# Altium project computadordebordo.PrjPcb
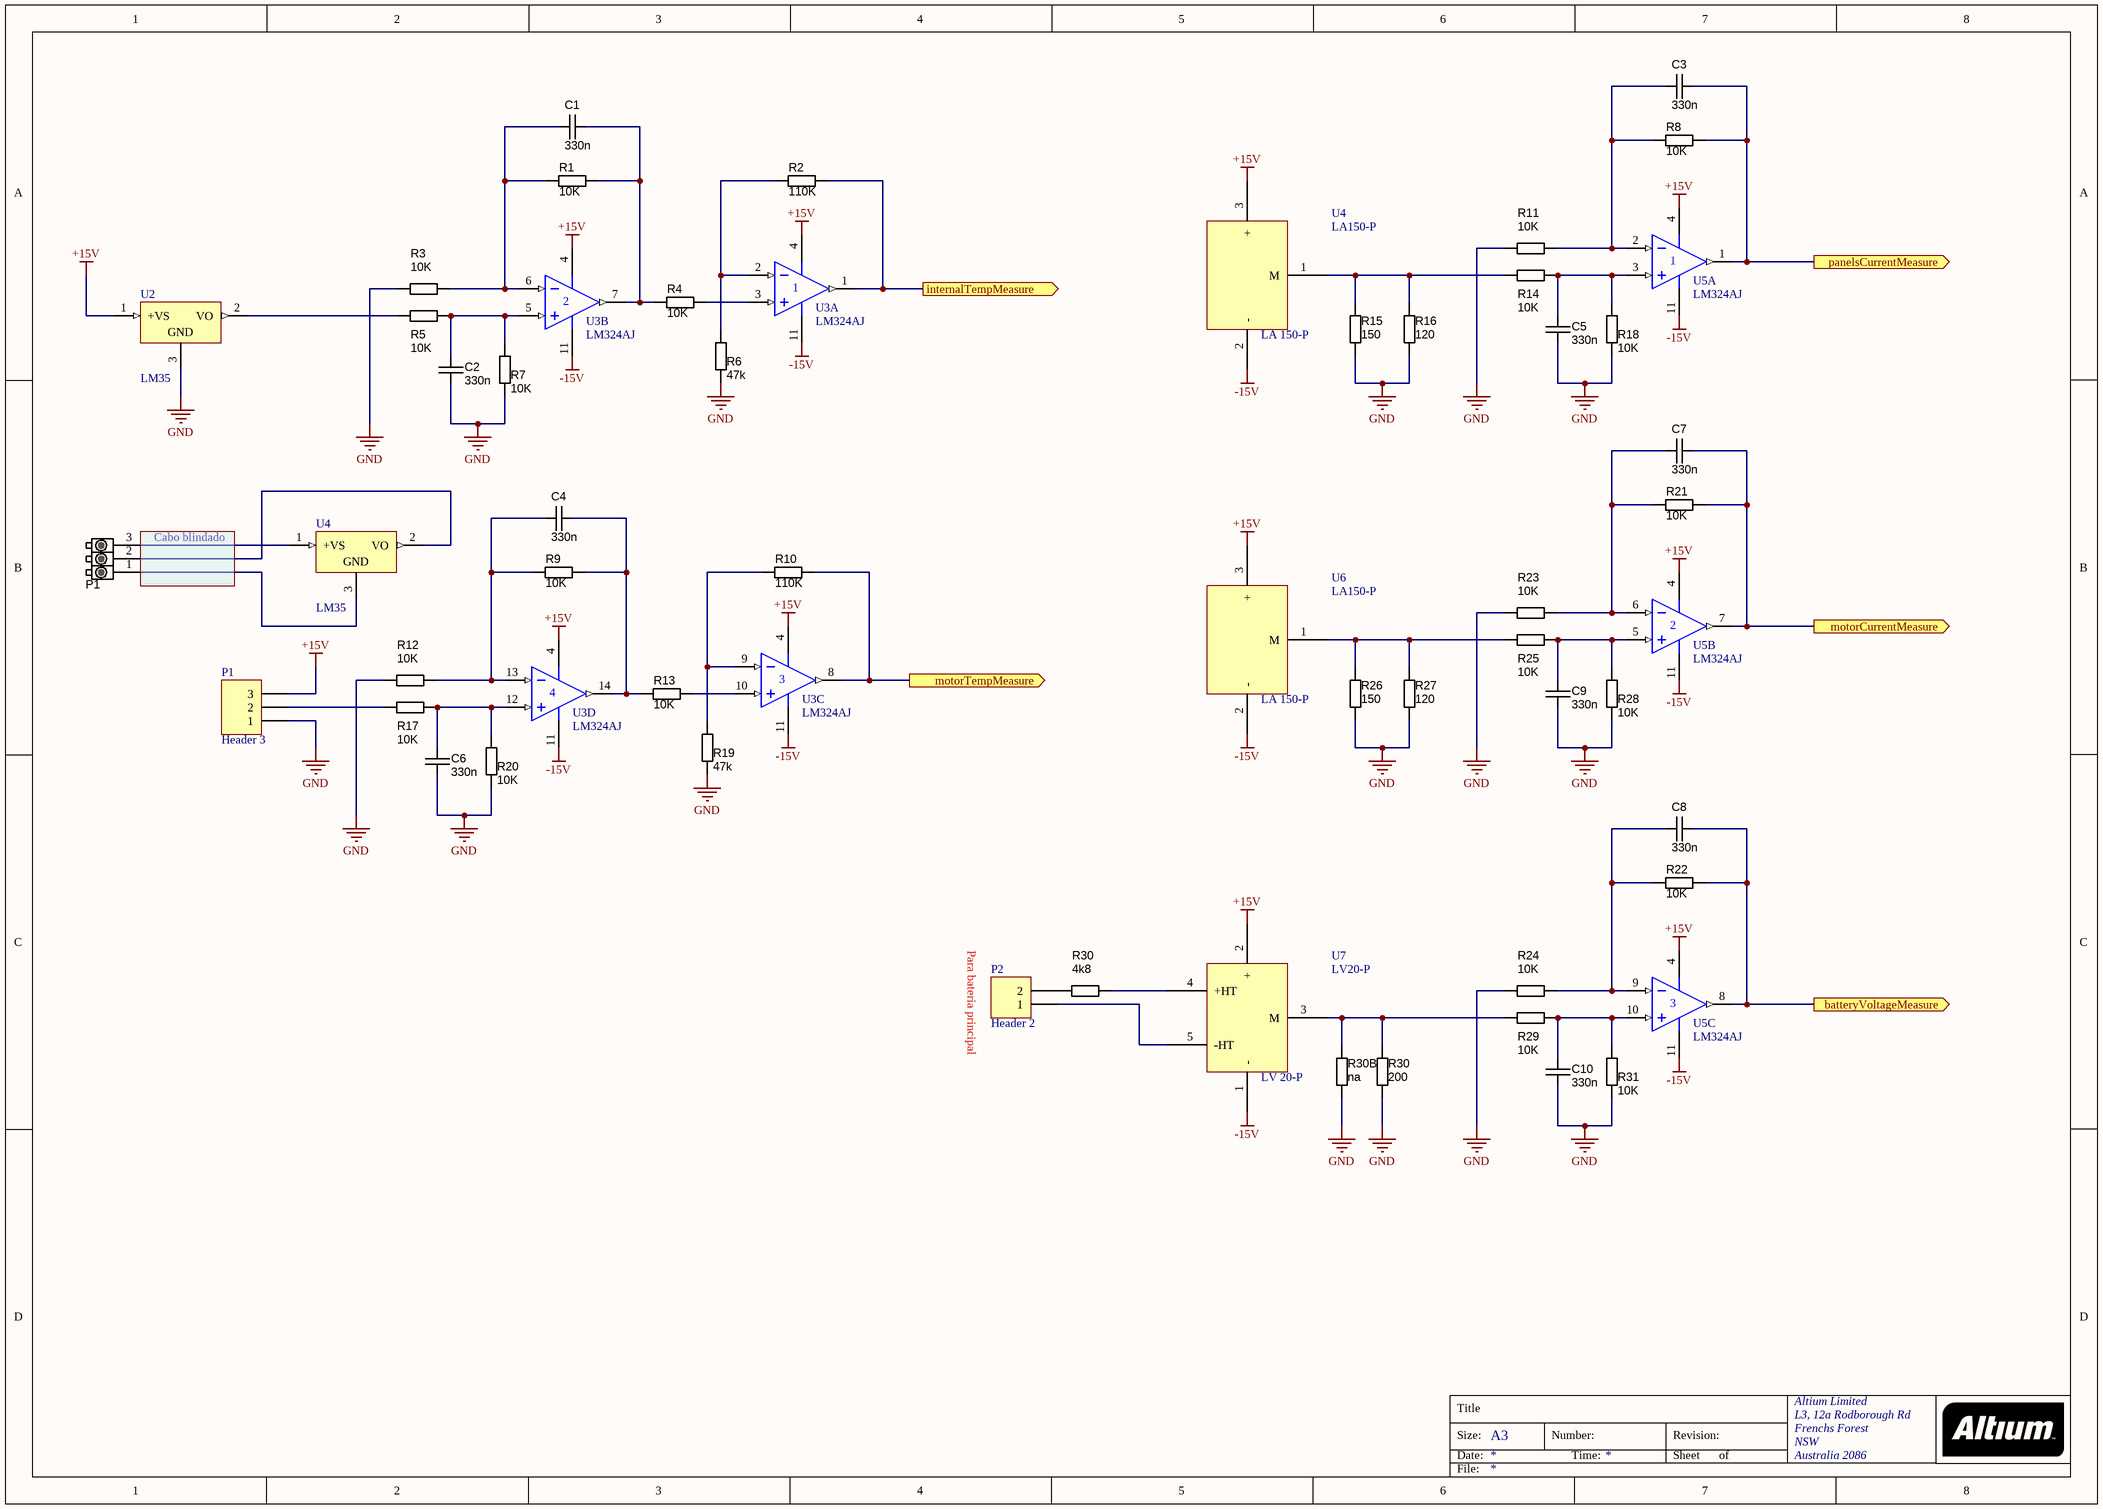
[diagram p0: sensor.SchDoc]
3 sheets, 93 parts. Net scope: flat (ports and power ports of the same name join across sheets).
Board files: PCB3_fresa_v1.1A.PcbDoc, PCB3_fresa_v1.1B.pcbdoc, PCB1.PcbDoc
Sheets:
  sensor.SchDoc
  supplies.SchDoc
  arduinoshield.SchDoc

## Sheet sensor.SchDoc
size A3; Organization: Altium Limited; Address1: L3, 12a Rodborough Rd; Address2: Frenchs Forest; Address3: NSW; Address4: Australia 2086

### Parts
(Parts that share a designator on the sheet are numbered #1, #2 ... from top to bottom, then left to right.)
C1  value 330n  [cap33n63v]  (hidden comment: approved sub OK)
C2  value 330n  [cap33n63v]  (hidden comment: approved sub OK)
C3  value 330n  [cap33n63v]  (hidden comment: approved sub OK)
C4  value 330n  [cap33n63v]  (hidden comment: approved sub OK)
C5  value 330n  [cap33n63v]  (hidden comment: approved sub OK)
C6  value 330n  [cap33n63v]  (hidden comment: approved sub OK)
C7  value 330n  [cap33n63v]  (hidden comment: approved sub OK)
C8  value 330n  [cap33n63v]  (hidden comment: approved sub OK)
C9  value 330n  [cap33n63v]  (hidden comment: approved sub OK)
C10  value 330n  [cap33n63v]  (hidden comment: approved sub OK)
P1#1  3P_TERM BLOCK PLUG  (value not drawn)  (graphical)
P1#2  Header 3  [HDR1X3]
P2  Header 2  [HDR1X2]
R1  value 10K  [RESTH_AXIAL-0.4]  (hidden comment: Carbon Film)
R2  value 110K  [RESTH_AXIAL-0.4]  (hidden comment: Carbon Film)
R3  value 10K  [RESTH_AXIAL-0.4]  (hidden comment: Carbon Film)
R4  value 10K  [RESTH_AXIAL-0.4]  (hidden comment: Carbon Film)
R5  value 10K  [RESTH_AXIAL-0.4]  (hidden comment: Carbon Film)
R6  value 47k  [RESTH_AXIAL-0.4]  (hidden comment: Carbon Film)
R7  value 10K  [RESTH_AXIAL-0.4]  (hidden comment: Carbon Film)
R8  value 10K  [RESTH_AXIAL-0.4]  (hidden comment: Carbon Film)
R9  value 10K  [RESTH_AXIAL-0.4]  (hidden comment: Carbon Film)
R10  value 110K  [RESTH_AXIAL-0.4]  (hidden comment: Carbon Film)
R11  value 10K  [RESTH_AXIAL-0.4]  (hidden comment: Carbon Film)
R12  value 10K  [RESTH_AXIAL-0.4]  (hidden comment: Carbon Film)
R13  value 10K  [RESTH_AXIAL-0.4]  (hidden comment: Carbon Film)
R14  value 10K  [RESTH_AXIAL-0.4]  (hidden comment: Carbon Film)
R15  value 150  [RESTH_AXIAL-0.4]  (hidden comment: Carbon Film)
R16  value 120  [RESTH_AXIAL-0.4]  (hidden comment: Carbon Film)
R17  value 10K  [RESTH_AXIAL-0.4]  (hidden comment: Carbon Film)
R18  value 10K  [RESTH_AXIAL-0.4]  (hidden comment: Carbon Film)
R19  value 47k  [RESTH_AXIAL-0.4]  (hidden comment: Carbon Film)
R20  value 10K  [RESTH_AXIAL-0.4]  (hidden comment: Carbon Film)
R21  value 10K  [RESTH_AXIAL-0.4]  (hidden comment: Carbon Film)
R22  value 10K  [RESTH_AXIAL-0.4]  (hidden comment: Carbon Film)
R23  value 10K  [RESTH_AXIAL-0.4]  (hidden comment: Carbon Film)
R24  value 10K  [RESTH_AXIAL-0.4]  (hidden comment: Carbon Film)
R25  value 10K  [RESTH_AXIAL-0.4]  (hidden comment: Carbon Film)
R26  value 150  [RESTH_AXIAL-0.4]  (hidden comment: Carbon Film)
R27  value 120  [RESTH_AXIAL-0.4]  (hidden comment: Carbon Film)
R28  value 10K  [RESTH_AXIAL-0.4]  (hidden comment: Carbon Film)
R29  value 10K  [RESTH_AXIAL-0.4]  (hidden comment: Carbon Film)
R30#1  value 4k8  [RESTH_AXIAL-0.4]  (hidden comment: Carbon Film)
R30#2  value 200  [RESTH_AXIAL-0.4]  (hidden comment: Carbon Film)
R30B  value na  [RESTH_AXIAL-0.4]  (hidden comment: Carbon Film)
R31  value 10K  [RESTH_AXIAL-0.4]  (hidden comment: Carbon Film)
U2  LM35  [Z03A]
U3  LM324AJ  [J014]  (parts A,B,C,D of 4)
U4#1  LA150-P  [LA150-P]
U4#2  LM35  [Z03A]  (graphical)
U5  LM324AJ  [J014]  (parts A,B,C of 4)
U6  LA150-P  [LA150-P]
U7  LV20-P  [LV20-P]

### Ports
batteryVoltageMeasure (out), internalTempMeasure (out), motorCurrentMeasure (out), motorTempMeasure (out), panelsCurrentMeasure (out)

### Nets
+15V: P1#2.3 U2.1(+VS) U3.4(V+) U4#1.3(+) U5.4(V+) U6.3(+) U7.2(+)
-15V: U3.11(V-) U4#1.2(-) U5.11(V-) U6.2(-) U7.1(-)
GND: C2.2 C5.2 C6.2 C9.2 C10.2 P1#2.1 R3.1 R6.2 R7.2 R11.1 R12.1 R15.2 R16.2 R18.2 R19.2 R20.2 R23.1 R24.1 R26.2 R27.2 R28.2 R30#2.2 R30B.2 R31.2 U2.3(GND)
AD0: R2.1 U3.1(OUT) ; port internalTempMeasure
AD1: R10.1 U3.8(OUT) ; port motorTempMeasure
AD2: C8.2 R22.2 U5.8(OUT) ; port batteryVoltageMeasure
AD3: C3.2 R8.2 U5.1(OUT) ; port panelsCurrentMeasure
AD4: C7.2 R21.2 U5.7(OUT) ; port motorCurrentMeasure
NetC1_1: C1.1 R1.1 R3.2 U3.6(IN-)
NetC1_2: C1.2 R1.2 R4.2 U3.7(OUT)
NetC2_1: C2.1 R5.2 R7.1 U3.5(IN+)
NetC3_1: C3.1 R8.1 R11.2 U5.2(IN-)
NetC4_1: C4.1 R9.1 R12.2 U3.13(IN-)
NetC4_2: C4.2 R9.2 R13.2 U3.14(OUT)
NetC5_1: C5.1 R14.2 R18.1 U5.3(IN+)
NetC6_1: C6.1 R17.2 R20.1 U3.12(IN+)
NetC7_1: C7.1 R21.1 R23.2 U5.6(IN-)
NetC8_1: C8.1 R22.1 R24.2 U5.9(IN-)
NetC9_1: C9.1 R25.2 R28.1 U5.5(IN+)
NetC10_1: C10.1 R29.2 R31.1 U5.10(IN+)
NetP1#1_1: P1#1.1 U4#2.3(GND)
NetP1#1_2: P1#1.2 U4#2.2(VO)
NetP1#1_3: P1#1.3 U4#2.1(+VS)
NetP1#2_2: P1#2.2 R17.1
NetP2_1: P2.1 U7.5(-HT)
NetP2_2: P2.2 R30#1.1
NetR2_2: R2.2 R6.1 U3.2(IN-)
NetR4_1: R4.1 U3.3(IN+)
NetR5_1: R5.1 U2.2(VO)
NetR10_2: R10.2 R19.1 U3.9(IN-)
NetR13_1: R13.1 U3.10(IN+)
NetR14_1: R14.1 R15.1 R16.1 U4#1.1(M)
NetR25_1: R25.1 R26.1 R27.1 U6.1(M)
NetR29_1: R29.1 R30#2.1 R30B.1 U7.3(M)
NetR30#1_2: R30#1.2 U7.4(+HT)

### Notes on the sheet
- (near P1#1) Cabo blindado
- Para bateria principal
- Title
- Size:
- Date:
- A3
- Number:
- Time:
- Revision:
- Sheet
- of
- File:
- (in symbol LA150-P) LA 150-P
- (in symbol LV20-P) LV 20-P

### Library data of the parts
C1-C10 = CAPC_330n_0805: Capacitor SMD Cer 330nF 10% 25V X7R 0805; Manufacturer: Kemet; Manufacturer Part Number: C0805C334K3RACTU; Ratings: 25V; X7R; Material: ceramic; Package / Case: 0805 (2012 metric); Tolerance: ±10%; Supplier 1: Mouser; Supplier Part Number 1: 80-C0805C334K3R
P1#1 = 3P_TERM BLOCK PLUG: Terminal block plug 3-position 3.81mm pitch; Manufacturer 1: TE Connectivity; Manufacturer Part Number 1: 284507-3; Pitch: 0.150" (3.81mm); Voltage: 300V; Mating Connector: 284517-3; Value: 3 position; Positions Per Level: 3; Plug Wire Entry: 180°; Wire Gauge: 14-30 AWG; Category: Connectors; Mounting Type: Free Hanging (In-Line); Terminal Block Type: Plug, Female Sockets; Supplier 1: Digi-Key; Supplier Part Number 1: A98380-ND; ComponentLink2URL: http://www.te.com/commerce/DocumentDelivery/DDEController?Action=srchrtrv&DocNm=284507&DocType=Customer+Drawing&DocLang=English; ComponentLink2Description: http://www.te.com/commerce/DocumentDelivery/DDEController?Action=srchrtrv&DocNm=284507&DocType=Customer+Drawing&DocLang=English
P1#2 = Header 3: Header, 3-Pin; LatestRevisionDate: 17-Jul-2002; LatestRevisionNote: Re-released for DXP Platform.; Publisher: Altium Limited
P2 = Header 2: Header, 2-Pin; LatestRevisionDate: 17-Jul-2002; LatestRevisionNote: Re-released for DXP Platform.; Publisher: Altium Limited
R1-R29 R30#1 R30#2 R30B R31 = RES_1K_Axial_0.25W_5%: Resistor THD Axial 1k Ohm 0.25W 5% Carbon Film; Manufacturer 1: Yageo; Manufacturer Part Number 1: CFR-25JB-1K0; Ratings: 1/4W; Tolerance: ±5%; Package / Case: Axial; Supplier 1: Digi-Key; Supplier Part Number 1: 1.0KQBK-ND
U2 U4#2 = LM35CAZ: Precision Centigrade Temperature Sensor, 3-pin TO-92; Manufacturer: National Semiconductor; PackageTopMarking: NSXYTT*LM35*CAZ; PowerWise: N; CompType: Temp Sensor IC; Published: 4-Dec-2008; LatestRevisionDate: 15-Jul-2009; LatestRevisionNote: Sch pins 1 & 3 reversed.; DatasheetVersion: Nov-2000; PackageVersion: revG, Sep-2000; PackageReference: Z03A; Publisher: Altium Limited; PackageDescription: TO-92, Molded, 3 Lead; Supplier 1: Farnell; Supplier Part Number 1: 9494529; PartNumber: LM35CAZ; RoHS: N; PinCount: 3; Code_JEDEC: TO-226-AA; ComponentLink1Description: LM35 Datasheet; ComponentLink1URL: http://www.national.com/ds/LM/LM35.pdf; ComponentLink2Description: LM35 Web Page; ComponentLink2URL: http://www.national.com/pf/LM/LM35.html; ComponentLink3Description: Z03A Package Page; ComponentLink3URL: http://www.national.com/packaging/folders/z03a.html
U3 U5 = LM324AJ: Quadruple Operational Amplifier; Published: 15-Apr-2002; LatestRevisionDate: 04-Mar-2005; LatestRevisionNote: Stylized 3D Model Added.; DatasheetVersion: Jan-1989; PackageVersion: Jun-1999; PackageReference: J014; Publisher: Altium Limited; PackageDescription: DIP; 14 Leads; Row Spacing 7.62 mm; Pitch 2.54 mm; ComponentLink1Description: Manufacturer Link; ComponentLink1URL: http://www.ti.com/; ComponentLink2Description: Datasheet; ComponentLink2URL: http://www-s.ti.com/sc/ds/lm324.pdf
U4#1 U6 = LA150-P: Current Transducer
U7 = LV20-P: Voltage Transducer

## Sheet supplies.SchDoc
size A4; Organization: Altium Limited; Address1: L3, 12a Rodborough Rd; Address2: Frenchs Forest; Address3: NSW; Address4: Australia 2086
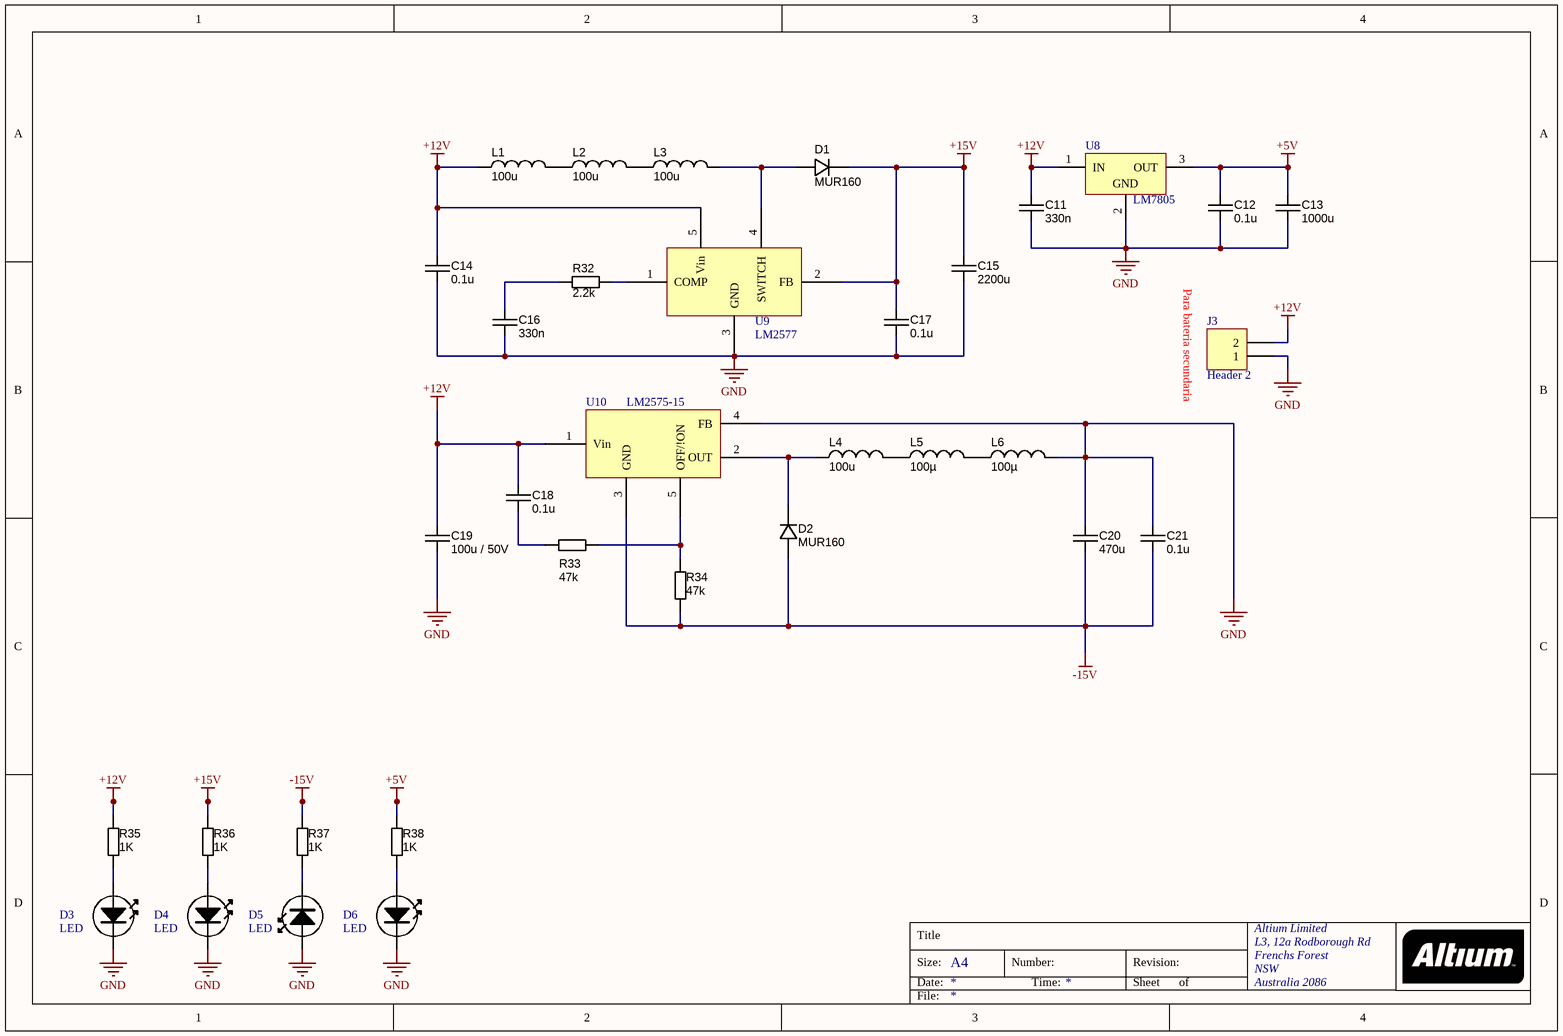
[diagram p1: supplies.SchDoc]

### Parts
C11  value 330n  [cap33n63v]  (hidden comment: approved sub OK)
C12  value 0.1u  [cap100n]  (hidden comment: approved sub OK)
C13  value 1000u  [cap1000u25v]  (hidden comment: approved sub OK)
C14  value 0.1u  [cap100n]  (hidden comment: approved sub OK)
C15  value 2200u  [cap2200u25v]  (hidden comment: approved sub OK)
C16  value 330n  [cap33n63v]  (hidden comment: approved sub OK)
C17  value 0.1u  [cap100n]  (hidden comment: approved sub OK)
C18  value 0.1u  [cap100n]  (hidden comment: approved sub OK)
C19  value 100u / 50V  [cap100u35v]  (hidden comment: approved sub OK)
C20  value 470u  [cap470u50v]  (hidden comment: approved sub OK)
C21  value 0.1u  [cap100n]  (hidden comment: approved sub OK)
D1  MUR160  [DO-41]
D2  MUR160  [DO-41]
D3  LED  [LED-3MM-BLUE]
D4  LED  [LED-3MM-BLUE]
D5  LED  [LED-3MM-BLUE]
D6  LED  [LED-3MM-BLUE]
J3  Header 2  [HDR1X2]
L1  value 100u  [Inductor]  (hidden comment: INDC_180u_Toroid)
L2  value 100u  [Inductor]  (hidden comment: INDC_180u_Toroid)
L3  value 100u  [Inductor]  (hidden comment: INDC_180u_Toroid)
L4  value 100u  [Inductor]  (hidden comment: INDC_180u_Toroid)
L5  value 100µ  [Inductor]  (hidden comment: INDC_180u_Toroid)
L6  value 100µ  [Inductor]  (hidden comment: INDC_180u_Toroid)
R32  value 2.2k  [RESTH_AXIAL-0.4]  (hidden comment: Carbon Film)
R33  value 47k  [RESTH_AXIAL-0.4]  (hidden comment: Carbon Film)
R34  value 47k  [RESTH_AXIAL-0.4]  (hidden comment: Carbon Film)
R35  value 1K  [RESTH_AXIAL-0.4]  (hidden comment: Carbon Film)
R36  value 1K  [RESTH_AXIAL-0.4]  (hidden comment: Carbon Film)
R37  value 1K  [RESTH_AXIAL-0.4]  (hidden comment: Carbon Film)
R38  value 1K  [RESTH_AXIAL-0.4]  (hidden comment: Carbon Film)
U8  LM7805  [T03B]
U9  LM2577  [T05A]
U10  LM2575-15  [T05A]

### Nets
+5V: C12.2 C13.2 R38.2 U8.3(OUT)  [project net 5V]
+12V: C11.2 C14.2 C18.2 C19.2 J3.2 L1.1 R35.2 U8.1(IN) U9.5(Vin) U10.1(Vin)
+15V: C15.2 C17.2 D1.K R36.2 U9.2(FB)
-15V: C20.1 C21.1 D2.A R34.1 R37.2 U10.3(GND)
GND: C11.1 C12.1 C13.1 C14.1 C15.1 C16.1 C17.1 C19.1 C20.2 C21.2 D3.K D4.K D5.A D6.K J3.1 L6.2 U8.2(GND) U9.3(GND) U10.4(FB)
NetC16_2: C16.2 R32.2
NetC18_1: C18.1 R33.1
NetD1_A: D1.A L3.2 U9.4(SWITCH)
NetD2_K: D2.K L4.1 U10.2(OUT)
NetD3_A: D3.A R35.1
NetD4_A: D4.A R36.1
NetD5_K: D5.K R37.1
NetD6_A: D6.A R38.1
NetL1_2: L1.2 L2.1
NetL2_2: L2.2 L3.1
NetL4_2: L4.2 L5.1
NetL5_2: L5.2 L6.1
NetR32_1: R32.1 U9.1(COMP)
NetR33_2: R33.2 R34.2 U10.5(OFF/!ON)

### Notes on the sheet
- Para bateria secundaria
- Title
- Size:
- Date:
- A4
- Number:
- Time:
- Revision:
- Sheet
- of
- File:

### Library data of the parts
C11-C21 = CAPC_330n_0805: as C1 on sheet sensor; Package / Case: 0805 (2012 metric); Tolerance: ±10%; Supplier 1: Mouser; Supplier Part Number 1: 80-C0805C334K3R
D1 D2 = DIODE_1N4007_1000V_1.0A_DO-41: Diode 1N4007 1A 1000V THD; Manufacturer 1: Diodes Inc; Manufacturer Part Number 1: 1N4007-T; Ratings: 100V; 1.5A; Diode Type: Standard; Value: Vf = 1.15V @ 1.5A (Max); Package / Case: DO-41; Mounting Type: Through Hole
D3-D6 = LED-BLUE-3MM
J3 = Header 2: Header, 2-Pin; LatestRevisionDate: 17-Jul-2002; LatestRevisionNote: Re-released for DXP Platform.; Publisher: Altium Limited
L1-L6 = INDC_180u_Toroid: Power Inductor 180µH 10% SMD Toroid; Manufacturer 1: JW Miller A Bourns Company; Manufacturer Part Number 1: PM2110-181K-RC; Ratings: 3.7A; Package / Case: 1.200" L x 1.000" W x 0.530" H; Tolerance: ±10%; Supplier 1: Digi-Key; Supplier Part Number 1: M8769-ND; Current: 3.7A
R32-R38 = RES_1K_Axial_0.25W_5%: as R1 on sheet sensor; Tolerance: ±5%; Package / Case: Axial; Supplier 1: Digi-Key; Supplier Part Number 1: 1.0KQBK-ND
U8 = LM78M05CT: 3-Terminal Positive Voltage Regulators, 3-pin TO-220; Manufacturer: National Semiconductor; PackageTopMarking: NSUZXYTTE#*LM341T-5.0*LM78M05CT; PowerWise: N; CompType: LDO IC; Published: 4-Dec-2008; DatasheetVersion: Aug-2005; PackageVersion: revL, Jan-1992; PackageReference: T03B; Publisher: Altium Limited; PackageDescription: TO-220, Molded, 3 Lead, Straight; Supplier 1: Farnell; Supplier Part Number 1: 4467103; PartNumber: LM78M05CT; RoHS: N; PinCount: 3; ComponentLink1Description: LM78M05 Datasheet; ComponentLink1URL: http://www.national.com/ds/LM/LM78M05.pdf; ComponentLink2Description: LM78M05 Web Page; ComponentLink2URL: http://www.national.com/pf/LM/LM78M05.html; ComponentLink3Description: T03B Package Page; ComponentLink3URL: http://www.national.com/packaging/folders/t03b.html
U9 = LM2577: Boost
U10 = LM2575: Buck

## Sheet arduinoshield.SchDoc
size A4; Organization: Altium Limited; Address1: L3, 12a Rodborough Rd; Address2: Frenchs Forest; Address3: NSW; Address4: Australia 2086
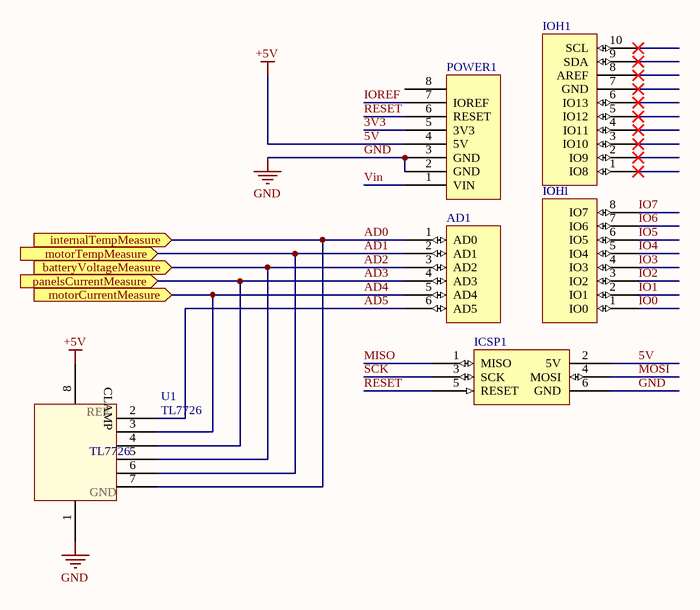
[diagram p2: arduinoshield.SchDoc]

### Parts
AD1  AD  [Header 6x1 8.5mm]  (value not drawn)
ICSP1  ICSP  [ICSP]  (value not drawn)  (mechanical)
IOH1  IOH  [Header 10x1 8.5mm]
IOL1  IOL  [Header 8x1 8.5mm]  (value not drawn)
POWER1  POWER_UNO  [Header 8x1 8.5mm]  (value not drawn)
U1  TL7726  [DIP8-300]

### Ports
batteryVoltageMeasure (in), internalTempMeasure (in), motorCurrentMeasure (in), motorTempMeasure (in), panelsCurrentMeasure (in)

### Nets
5V: ICSP1.2(5V) POWER1.4(5V) U1.8(REF)  [also labelled +5V]
GND: ICSP1.6(GND) POWER1.2(GND) POWER1.3(GND) U1.1(GND)
3V3: POWER1.5(3V3)
AD0: AD1.1(AD0) U1.7(CLAMP) ; port internalTempMeasure
AD1: AD1.2(AD1) U1.6(CLAMP) ; port motorTempMeasure
AD2: AD1.3(AD2) U1.5(CLAMP) ; port batteryVoltageMeasure
AD3: AD1.4(AD3) U1.4(CLAMP) ; port panelsCurrentMeasure
AD4: AD1.5(AD4) U1.3(CLAMP) ; port motorCurrentMeasure
AD5: AD1.6(AD5) U1.2(CLAMP)
IO0: IOL1.1(IO0)
IO1: IOL1.2(IO1)
IO2: IOL1.3(IO2)
IO3: IOL1.4(IO3)
IO4: IOL1.5(IO4)
IO5: IOL1.6(IO5)
IO6: IOL1.7(IO6)
IO7: IOL1.8(IO7)
IOREF: POWER1.7(IOREF)
MISO: ICSP1.1(MISO)
MOSI: ICSP1.4(MOSI)
RESET: ICSP1.5(RESET) POWER1.6(RESET)
SCK: ICSP1.3(SCK)
Vin: POWER1.1(VIN)

Not connected (* = marked no-connect by the designer): IOH1 1(IO8)* 2(IO9)* 3(IO10)* 4(IO11)* 5(IO12)* 6(IO13)* 7(GND)* 8(AREF)* 9(SDA)* 10(SCL)*; POWER1 8

### Notes on the sheet
- Title
- Size:
- Date:
- A4
- Number:
- Time:
- Revision:
- Sheet
- of
- File:

### Library data of the parts
U1 = TL7726: Hex Clamping Circuit - Overvoltage Limiter

## Nets that join several sheets
5V: supplies (C12.2 C13.2 R38.2 U8.3), arduinoshield (ICSP1.2 POWER1.4 U1.8)
+15V: sensor (7 pins), supplies (5 pins)
-15V: sensor (5 pins), supplies (6 pins)
GND: sensor (25 pins), supplies (19 pins), arduinoshield (ICSP1.6 POWER1.2 POWER1.3 U1.1)
AD0: sensor (R2.1 U3.1), arduinoshield (AD1.1 U1.7)
AD1: sensor (R10.1 U3.8), arduinoshield (AD1.2 U1.6)
AD2: sensor (C8.2 R22.2 U5.8), arduinoshield (AD1.3 U1.5)
AD3: sensor (C3.2 R8.2 U5.1), arduinoshield (AD1.4 U1.4)
AD4: sensor (C7.2 R21.2 U5.7), arduinoshield (AD1.5 U1.3)